# EAGLE schematic Trabalho CORRETO (EAGLE 8.2.1)
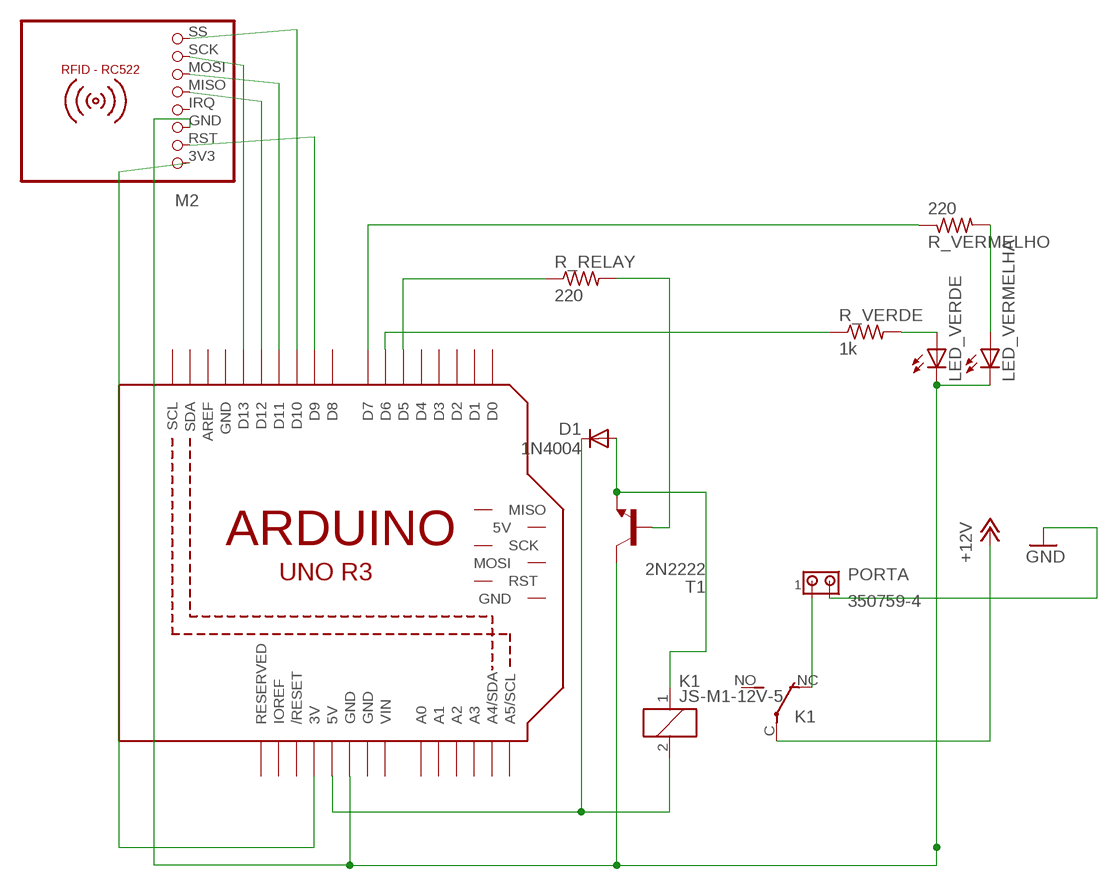
[diagram p0: schematic, sheet 1]

## Parts
D1  1N4004  [DO41-10]
K1  JS-M1-12V-5  [JS-M]
LED_VERDE  LED5MM  [LED5MM]
LED_VERMELHA  LED5MM  [LED5MM]
M1  ARDUINO_R3_ICSP  [ARDUINOR3_ICSP]
M2  RFID-RC522  [RFID-RC522]
PORTA  350759-4  [350759-4]
R_RELAY  220  R-US_0204/5  [0204/5]
R_VERDE  1k  R-US_0204/5  [0204/5]
R_VERMELHO  220  R-US_0204/5  [0204/5]
T1  2N2222  [TO92-EBC-OVAL]

## Nets
3.3V: M1.3V M2.3V3
+12V: K1.C(2:P)
D6: M1.D6 R_VERDE.1
D7: M1.D7 R_VERMELHO.1
D9: M1.D9 M2.RST
D10: M1.D10 M2.SS
D11: M1.D11 M2.MOSI
D12: M1.D12 M2.MISO
D13: M1.D13 M2.SCK
GND: LED_VERDE.K(C) LED_VERMELHA.K(C) M1.GND@1(GND) M2.GND PORTA.2 T1.C
N$1: R_RELAY.2 T1.B
N$2: LED_VERDE.A R_VERDE.2
N$3: LED_VERMELHA.A R_VERMELHO.2
N$4: D1.C K1.2 M1.5V
N$5: M1.D5 R_RELAY.1
N$6: D1.A K1.1 T1.E
N$7: K1.NC(2:O) PORTA.1
Unconnected: K1.NO(2:S) M1.5V_ICSP(5V) M1.A0 M1.A1 M1.A2 M1.A3 M1.A4(A4/SDA) M1.A5(A5/SCL) M1.AREF M1.D0 M1.D1 M1.D2 M1.D3 M1.D4 M1.D8 M1.GND@2(GND) M1.IOREF M1.MISO M1.MOSI M1.RESERVED M1.RESET(/RESET) M1.RESET_ICSP(RST) M1.SCK M1.SCL M1.SDA M2.IRQ

## Power pins joined to a net without a drawn wire
GND: M1.GND M1.GND@3(GND)
VIN: M1.VIN

## Library data of the parts
D1 = adafruit:1N4004: DIODE General purpose 1N400x type rectifier (With bigger pads) http://www.ladyada.net/library/pcb/eaglelibrary.html
K1 = relay:JS-M1*: Automotive Ultra-Miniature Power Relay NAiS Source: http://www.mew-europe.com/.. en_ds_61211_0000.pdf; MF: FARNELL; MPN: JSM1-12V-5; OC_FARNELL: 910351; OC_NEWARK: 14J1764
LED_VERDE LED_VERMELHA = adafruit:LED: LED OSRAM: - CHIPLED LG R971, LG N971, LY N971, LG Q971, LY Q971, LO R971, LY R971 LH N974, LH R974 LS Q976, LO Q976, LY Q976 LO Q996 - Hyper CHIPLED LW Q18S LB Q993, LB Q99A, LB R99A - SideLED LS A670, LO A670, LY A670, LG A670, LP A670 LB A673, LV A673, LT A673, LW A673 LH A674 LY A675 LS A676, LA A676, LO A676, LY A676, LW A676 LS A679, LY A679, LG A679 - Hyper Micro SIDELED® LS Y876, LA Y876, LO Y876, LY Y876 LT Y87S - SmartLED LW L88C, LW L88S LB L89C, LB L89S, LG L890 LS L89K, LO L89K, LY L89K LS L896, LA L896, LO L896, LY L896 - TOPLED LS T670, LO T670, LY T670, LG T670, LP T670 LSG T670, LSP T670, LSY T670, LOP T670, LYG T670 LG T671, LOG T671, LSG T671 LB T673, LV T673, LT T673, LW T673 LH T674 LS T676, LA T676, LO T676, LY T676, LB T676, LH T676, LSB T676, LW T676 LB T67C, LV T67C, LT T67C, LS T67K, LO T67K, LY T67K, LW E67C LS E67B, LA E67B, LO E67B, LY E67B, LB E67C, LV E67C, LT E67C LW T67C LS T679, LY T679, LG T679 LS T770, LO T770, LY T770, LG T770, LP T770 LB T773, LV T773, LT T773, LW T773 LH T774 LS E675, LA E675, LY E675, LS T675 LS T776, LA T776, LO T776, LY T776, LB T776 LHGB T686 LT T68C, LB T68C - Hyper Mini TOPLED® LB M676 - Mini TOPLED Santana® LG M470 LS M47K, LO M47K, LY M47K Source: http://www.osram.convergy.de/
M1 = adafruit:ARDUINO_R3_ICSP
M2 = mfrc522-module:RFID-RC522: RFID-RC522 MFRC-522 based breakout board
PORTA = con-amp:350759-4: Universal MATE-N-LOK .250" Centerline, 600 V, 19 - 36 A max Source: http://catalog.tycoelectronics.com/ .. ENG_CD_350759_R.pdf
R_RELAY R_VERDE R_VERMELHO = adafruit:R-US_: RESISTOR, American symbol
T1 = adafruit:2N2222: NPN TRANSISTOR Big oval pads